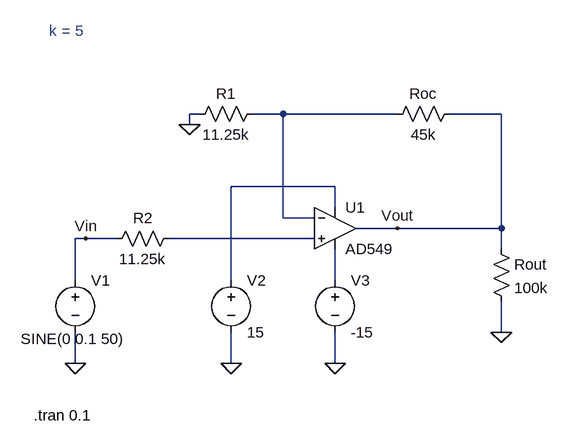
[diagram p0: schematic Draft2.asc]
Draft2.asc, the LTspice schematic file:
Version 4
SHEET 1 880 680
WIRE 16 -16 0 -16
WIRE 144 -16 96 -16
WIRE 320 -16 144 -16
WIRE 480 -16 400 -16
WIRE 0 0 0 -16
WIRE 224 96 64 96
WIRE 224 128 224 96
WIRE 144 144 144 -16
WIRE 192 144 144 144
WIRE 320 160 256 160
WIRE 480 160 480 -16
WIRE 480 160 320 160
WIRE -160 176 -176 176
WIRE -112 176 -160 176
WIRE 192 176 -32 176
WIRE 480 192 480 160
WIRE -176 240 -176 176
WIRE 64 240 64 96
WIRE 224 240 224 192
WIRE 480 320 480 272
WIRE -176 368 -176 320
WIRE 64 368 64 320
WIRE 224 368 224 320
FLAG 480 320 0
FLAG -160 176 Vin
FLAG 320 160 Vout
FLAG -176 368 0
FLAG 64 368 0
FLAG 224 368 0
FLAG 0 0 0
SYMBOL OpAmps\\AD549 224 96 R0
SYMATTR InstName U1
SYMBOL voltage 64 224 R0
WINDOW 123 0 0 Left 0
WINDOW 39 0 0 Left 0
SYMATTR InstName V2
SYMATTR Value 15
SYMBOL voltage -176 224 R0
WINDOW 3 -84 106 Left 2
WINDOW 123 0 0 Left 0
WINDOW 39 0 0 Left 0
SYMATTR Value SINE(0 0.1 50)
SYMATTR InstName V1
SYMBOL voltage 224 224 R0
WINDOW 123 0 0 Left 0
WINDOW 39 0 0 Left 0
SYMATTR InstName V3
SYMATTR Value -15
SYMBOL res -16 160 R90
WINDOW 0 0 56 VBottom 2
WINDOW 3 32 56 VTop 2
SYMATTR InstName R2
SYMATTR Value 11.25k
SYMBOL res 304 0 R270
WINDOW 0 32 56 VTop 2
WINDOW 3 0 56 VBottom 2
SYMATTR InstName Roc
SYMATTR Value 45k
SYMBOL res 464 176 R0
SYMATTR InstName Rout
SYMATTR Value 100k
SYMBOL res 112 -32 R90
WINDOW 0 0 56 VBottom 2
WINDOW 3 32 56 VTop 2
SYMATTR InstName R1
SYMATTR Value 11.25k
TEXT -216 -144 Left 2 ;k = 5
TEXT -240 448 Left 2 !.tran 0.1

The netlist it stands for:
* Draft2.asc
XU1 N003 N001 N002 N004 Vout AD549  ; pins In+ In- V+ V- OUT
V2 N002 0 15
V1 Vin 0 SINE(0 0.1 50)
V3 N004 0 -15
R2 N003 Vin 11.25k
Roc N001 Vout 45k
Rout Vout 0 100k
R1 N001 0 11.25k
* k = 5
.tran 0.1
.backanno
.end